# Altium schematic sheet [10] - CONNECTORs.SchDoc
size A3; DocumentNumber: 11; SheetNumber: 11; SheetTotal: 12
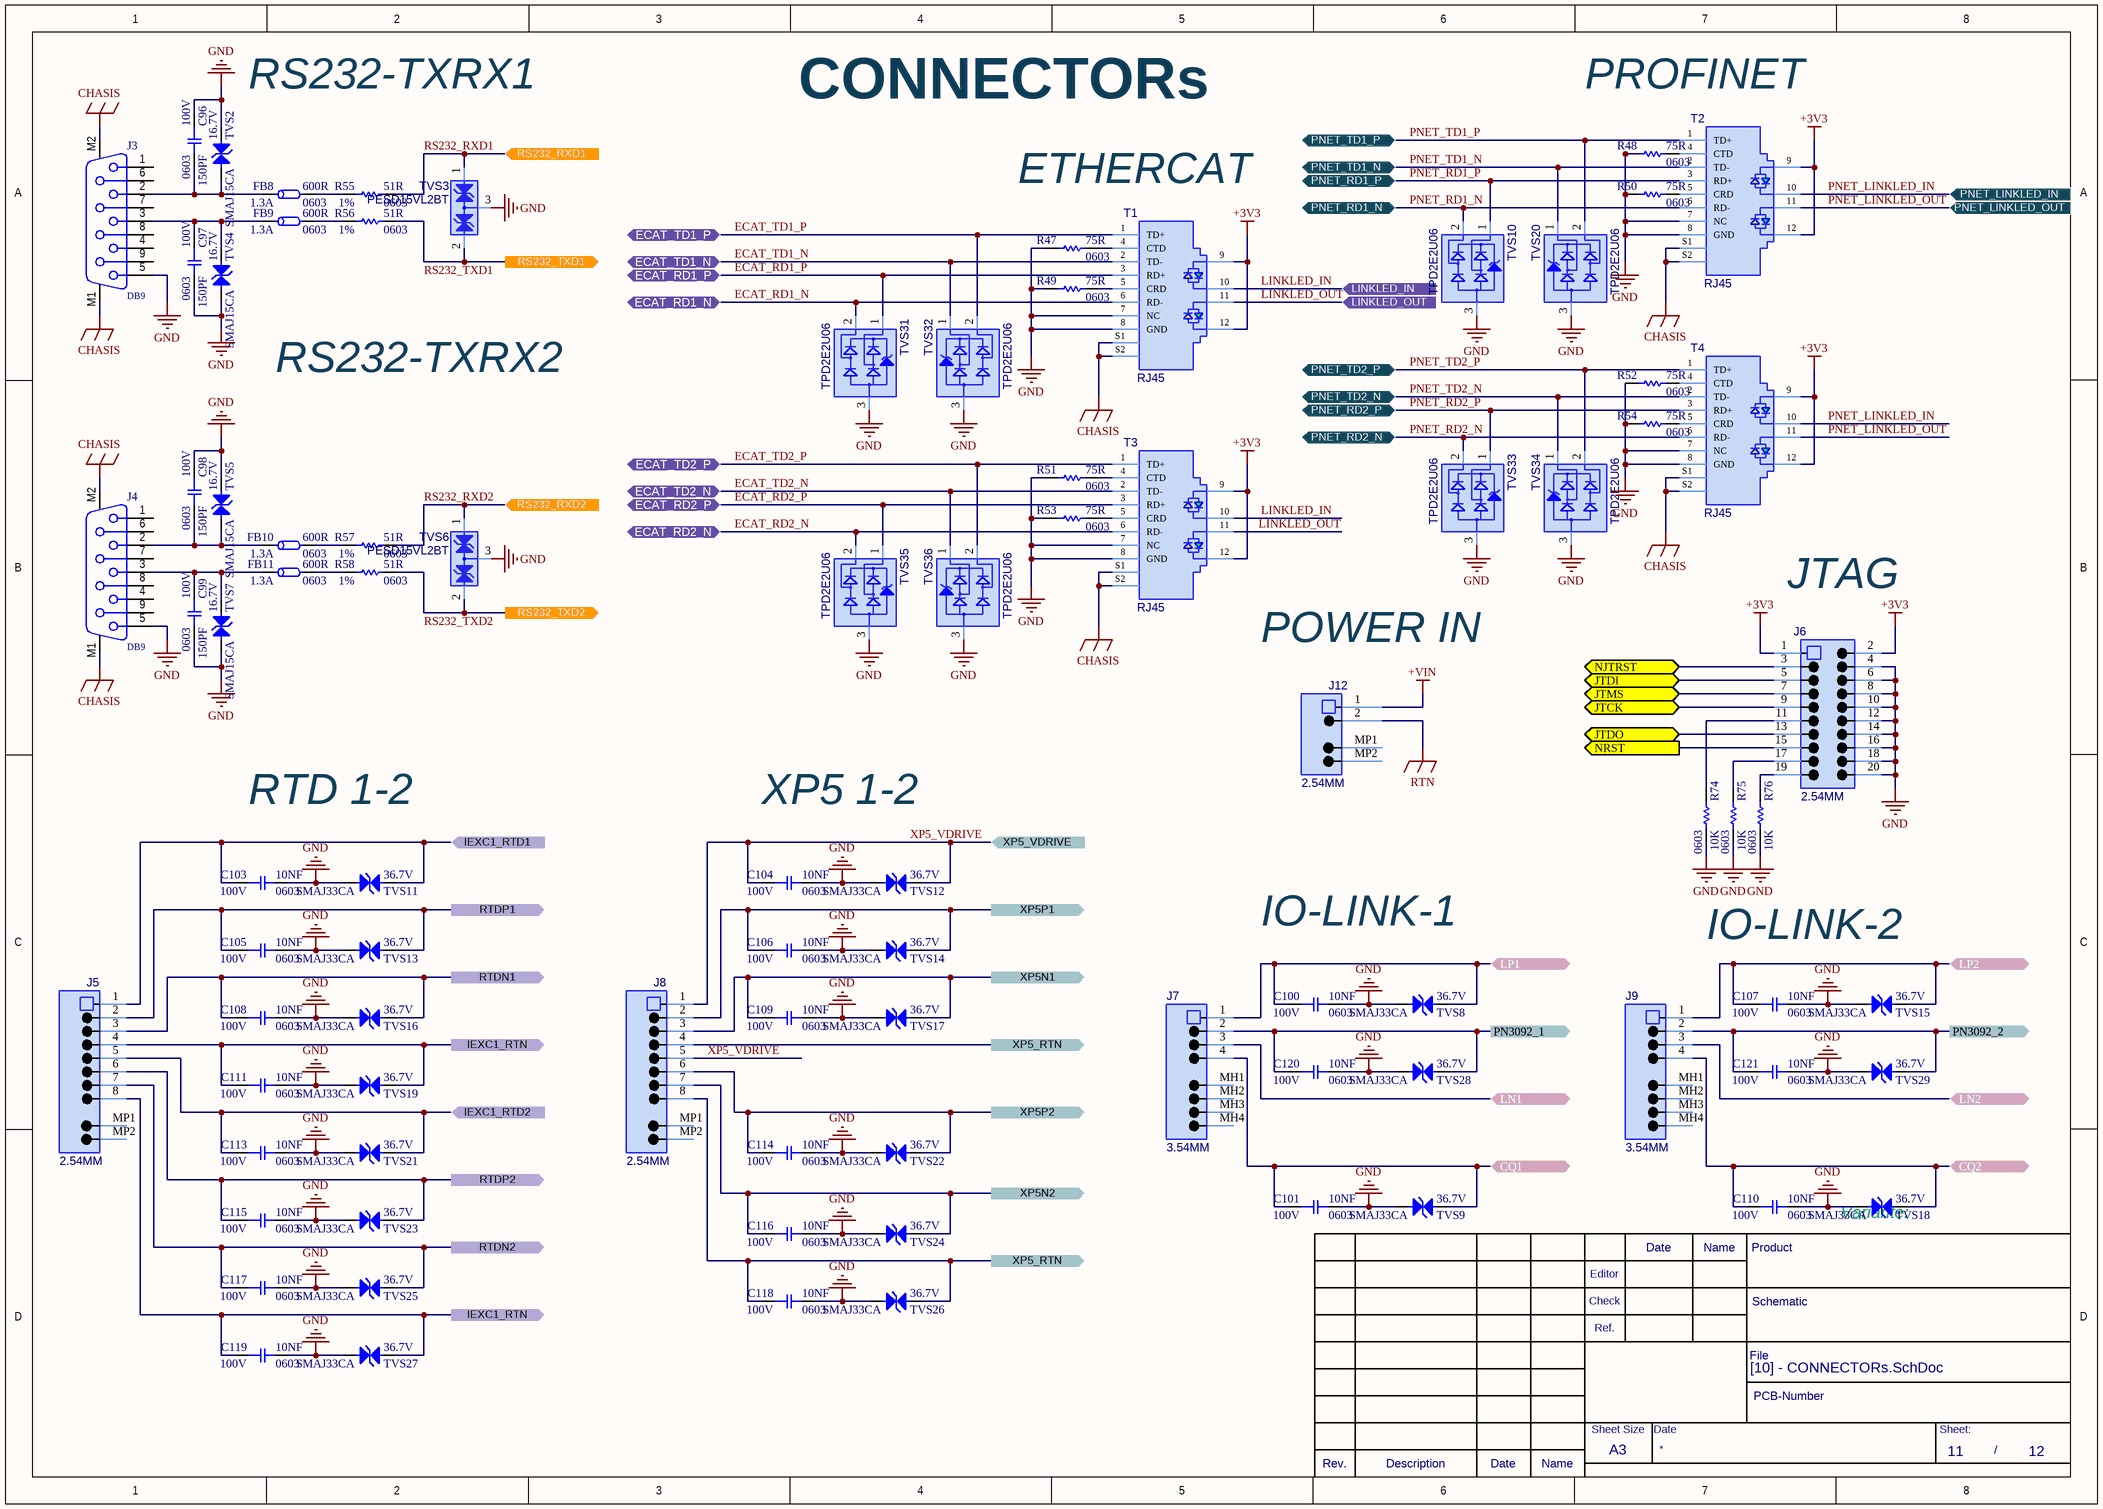
[diagram p0: [10] - CONNECTORs.SchDoc]

## Parts
C96  150PF  Case/Package: 0603  Voltage Rating: 100V  [C-0603]
C97  150PF  Case/Package: 0603  Voltage Rating: 100V  [C-0603]
C98  150PF  Case/Package: 0603  Voltage Rating: 100V  [C-0603]
C99  150PF  Case/Package: 0603  Voltage Rating: 100V  [C-0603]
C100  10NF  Voltage Rating: 100V  Case Code (Imperial): 0603  [C-0603]
C101  10NF  Voltage Rating: 100V  Case Code (Imperial): 0603  [C-0603]
C103  10NF  Voltage Rating: 100V  Case Code (Imperial): 0603  [C-0603]
C104  10NF  Voltage Rating: 100V  Case Code (Imperial): 0603  [C-0603]
C105  10NF  Voltage Rating: 100V  Case Code (Imperial): 0603  [C-0603]
C106  10NF  Voltage Rating: 100V  Case Code (Imperial): 0603  [C-0603]
C107  10NF  Voltage Rating: 100V  Case Code (Imperial): 0603  [C-0603]
C108  10NF  Voltage Rating: 100V  Case Code (Imperial): 0603  [C-0603]
C109  10NF  Voltage Rating: 100V  Case Code (Imperial): 0603  [C-0603]
C110  10NF  Voltage Rating: 100V  Case Code (Imperial): 0603  [C-0603]
C111  10NF  Voltage Rating: 100V  Case Code (Imperial): 0603  [C-0603]
C113  10NF  Voltage Rating: 100V  Case Code (Imperial): 0603  [C-0603]
C114  10NF  Voltage Rating: 100V  Case Code (Imperial): 0603  [C-0603]
C115  10NF  Voltage Rating: 100V  Case Code (Imperial): 0603  [C-0603]
C116  10NF  Voltage Rating: 100V  Case Code (Imperial): 0603  [C-0603]
C117  10NF  Voltage Rating: 100V  Case Code (Imperial): 0603  [C-0603]
C118  10NF  Voltage Rating: 100V  Case Code (Imperial): 0603  [C-0603]
C119  10NF  Voltage Rating: 100V  Case Code (Imperial): 0603  [C-0603]
C120  10NF  Voltage Rating: 100V  Case Code (Imperial): 0603  [C-0603]
C121  10NF  Voltage Rating: 100V  Case Code (Imperial): 0603  [C-0603]
FB8  600R  Current Rating: 1.3A  Case Code (Imperial): 0603  [FB-0603]
FB9  600R  Current Rating: 1.3A  Case Code (Imperial): 0603  [FB-0603]
FB10  600R  Current Rating: 1.3A  Case Code (Imperial): 0603  [FB-0603]
FB11  600R  Current Rating: 1.3A  Case Code (Imperial): 0603  [FB-0603]
J3  DB9  [CON-DB9-618009211821]
J4  DB9  [CON-DB9-618009211821]
J5  2.54MM  [CON-HARTING-8POS-2.54MM]
J6  2.54MM  [CON-SWD-20 POSITION]
J7  3.54MM  [CON-4PIN-IOLINK]
J8  2.54MM  [CON-HARTING-8POS-2.54MM]
J9  3.54MM  [CON-4PIN-IOLINK]
J12  2.54MM  [CON-HARTING-2POS-2.54MM]
R47  75R  Case/Package: 0603  [R-0603]
R48  75R  Case/Package: 0603  [R-0603]
R49  75R  Case/Package: 0603  [R-0603]
R50  75R  Case/Package: 0603  [R-0603]
R51  75R  Case/Package: 0603  [R-0603]
R52  75R  Case/Package: 0603  [R-0603]
R53  75R  Case/Package: 0603  [R-0603]
R54  75R  Case/Package: 0603  [R-0603]
R55  51R  Tolerance: 1%  Case/Package: 0603  [R-0603]
R56  51R  Tolerance: 1%  Case/Package: 0603  [R-0603]
R57  51R  Tolerance: 1%  Case/Package: 0603  [R-0603]
R58  51R  Tolerance: 1%  Case/Package: 0603  [R-0603]
R74  10K  Case Code (Imperial): 0603  [R-0603]
R75  10K  Case Code (Imperial): 0603  [R-0603]
R76  10K  Case Code (Imperial): 0603  [R-0603]
T1  RJ45  [CON-RJ45-74980104400]
T2  RJ45  [CON-RJ45-74980104400]
T3  RJ45  [CON-RJ45-74980104400]
T4  RJ45  [CON-RJ45-74980104400]
TVS2  SMAJ15CA  Min Breakdown Voltage: 16.7V  [D-SMA-DO214AC-CA]
TVS3  PESD15VL2BT  [SOT23-3]
TVS4  SMAJ15CA  Min Breakdown Voltage: 16.7V  [D-SMA-DO214AC-CA]
TVS5  SMAJ15CA  Min Breakdown Voltage: 16.7V  [D-SMA-DO214AC-CA]
TVS6  PESD15VL2BT  [SOT23-3]
TVS7  SMAJ15CA  Min Breakdown Voltage: 16.7V  [D-SMA-DO214AC-CA]
TVS8  SMAJ33CA  Reverse Breakdown Voltage: 36.7V  [D-SMA-DO214AC-CA]
TVS9  SMAJ33CA  Reverse Breakdown Voltage: 36.7V  [D-SMA-DO214AC-CA]
TVS10  TPD2E2U06  [SOT323-3]
TVS11  SMAJ33CA  Reverse Breakdown Voltage: 36.7V  [D-SMA-DO214AC-CA]
TVS12  SMAJ33CA  Reverse Breakdown Voltage: 36.7V  [D-SMA-DO214AC-CA]
TVS13  SMAJ33CA  Reverse Breakdown Voltage: 36.7V  [D-SMA-DO214AC-CA]
TVS14  SMAJ33CA  Reverse Breakdown Voltage: 36.7V  [D-SMA-DO214AC-CA]
TVS15  SMAJ33CA  Reverse Breakdown Voltage: 36.7V  [D-SMA-DO214AC-CA]
TVS16  SMAJ33CA  Reverse Breakdown Voltage: 36.7V  [D-SMA-DO214AC-CA]
TVS17  SMAJ33CA  Reverse Breakdown Voltage: 36.7V  [D-SMA-DO214AC-CA]
TVS18  SMAJ33CA  Reverse Breakdown Voltage: 36.7V  [D-SMA-DO214AC-CA]
TVS19  SMAJ33CA  Reverse Breakdown Voltage: 36.7V  [D-SMA-DO214AC-CA]
TVS20  TPD2E2U06  [SOT323-3]
TVS21  SMAJ33CA  Reverse Breakdown Voltage: 36.7V  [D-SMA-DO214AC-CA]
TVS22  SMAJ33CA  Reverse Breakdown Voltage: 36.7V  [D-SMA-DO214AC-CA]
TVS23  SMAJ33CA  Reverse Breakdown Voltage: 36.7V  [D-SMA-DO214AC-CA]
TVS24  SMAJ33CA  Reverse Breakdown Voltage: 36.7V  [D-SMA-DO214AC-CA]
TVS25  SMAJ33CA  Reverse Breakdown Voltage: 36.7V  [D-SMA-DO214AC-CA]
TVS26  SMAJ33CA  Reverse Breakdown Voltage: 36.7V  [D-SMA-DO214AC-CA]
TVS27  SMAJ33CA  Reverse Breakdown Voltage: 36.7V  [D-SMA-DO214AC-CA]
TVS28  SMAJ33CA  Reverse Breakdown Voltage: 36.7V  [D-SMA-DO214AC-CA]
TVS29  SMAJ33CA  Reverse Breakdown Voltage: 36.7V  [D-SMA-DO214AC-CA]
TVS31  TPD2E2U06  [SOT323-3]
TVS32  TPD2E2U06  [SOT323-3]
TVS33  TPD2E2U06  [SOT323-3]
TVS34  TPD2E2U06  [SOT323-3]
TVS35  TPD2E2U06  [SOT323-3]
TVS36  TPD2E2U06  [SOT323-3]

## Ports
CQ1 (bidir), CQ2 (bidir), ECAT_RD1_N (bidir), ECAT_RD1_P (bidir), ECAT_RD2_N (bidir), ECAT_RD2_P (bidir), ECAT_TD1_N (bidir), ECAT_TD1_P (bidir), ECAT_TD2_N (bidir), ECAT_TD2_P (bidir), IEXC1_RTD1 (in), IEXC1_RTD2 (in), IEXC1_RTN (out), JTCK (bidir), JTDI (bidir), JTDO (bidir), JTMS (bidir), LINKLED_IN (in), LINKLED_OUT (in), LN1 (bidir), LN2 (bidir), LP1 (bidir), LP2 (bidir), NJTRST (bidir), NRST (out), PN3092_1 (out), PN3092_2 (out), PNET_LINKLED_IN (in), PNET_LINKLED_OUT (in), PNET_RD1_N (bidir), PNET_RD1_P (bidir), PNET_RD2_N (bidir), PNET_RD2_P (bidir), PNET_TD1_N (bidir), PNET_TD1_P (bidir), PNET_TD2_N (bidir), PNET_TD2_P (bidir), RS232_RXD1 (in), RS232_RXD2 (in), RS232_TXD1 (out), RS232_TXD2 (out), RTDN1 (out), RTDN2 (out), RTDP1 (out), RTDP2 (out), XP5_RTN (out), XP5_VDRIVE (in), XP5N1 (out), XP5N2 (out), XP5P1 (out), XP5P2 (out)

## Nets
+3V3: J6.1 J6.2 T1.9 T1.12 T2.9 T2.12 T3.9 T3.12 T4.9 T4.12
+VIN: J12.1(GND_IN)
CHASIS: J3.M1 J3.M2 J4.M1 J4.M2 T1.S1(Shield) T1.S2(Shield) T2.S1(Shield) T2.S2(Shield) T3.S1(Shield) T3.S2(Shield) T4.S1(Shield) T4.S2(Shield)
GND: C96.1 C97.2 C98.1 C99.2 C100.2 C101.2 C103.2 C104.2 C105.2 C106.2 C107.2 C108.2 C109.2 C110.2 C111.2 C113.2 C114.2 C115.2 C116.2 C117.2 C118.2 C119.2 C120.2 C121.2 J3.5 J4.5 J6.4 J6.6 J6.8 J6.10 J6.12 J6.14 J6.16 J6.18 J6.20 R47.1 R48.1 R49.1 R50.1 R51.1 R52.1 R53.1 R54.1 R74.2 R75.2 R76.2 T1.7(NC) T1.8(GND) T2.7(NC) T2.8(GND) T3.7(NC) T3.8(GND) T4.7(NC) T4.8(GND) TVS2.A TVS3.3(GND) TVS4.C TVS5.A TVS6.3(GND) TVS7.C TVS8.C TVS9.C TVS10.3(GND) TVS11.C TVS12.C TVS13.C TVS14.C TVS15.C TVS16.C TVS17.C TVS18.C TVS19.C TVS20.3(GND) TVS21.C TVS22.C TVS23.C TVS24.C TVS25.C TVS26.C TVS27.C TVS28.C TVS29.C TVS31.3(GND) TVS32.3(GND) TVS33.3(GND) TVS34.3(GND) TVS35.3(GND) TVS36.3(GND)
RTN: J12.2
CQ1: C101.1 J7.4 TVS9.A ; port CQ1
CQ2: C110.1 J9.4 TVS18.A ; port CQ2
ECAT_RD1_N: T1.6(RD-) TVS31.2(I/O2) ; port ECAT_RD1_N
ECAT_RD1_P: T1.3(RD+) TVS31.1(I/O1) ; port ECAT_RD1_P
ECAT_RD2_N: T3.6(RD-) TVS35.2(I/O2) ; port ECAT_RD2_N
ECAT_RD2_P: T3.3(RD+) TVS35.1(I/O1) ; port ECAT_RD2_P
ECAT_TD1_N: T1.2(TD-) TVS32.1(I/O1) ; port ECAT_TD1_N
ECAT_TD1_P: T1.1(TD+) TVS32.2(I/O2) ; port ECAT_TD1_P
ECAT_TD2_N: T3.2(TD-) TVS36.1(I/O1) ; port ECAT_TD2_N
ECAT_TD2_P: T3.1(TD+) TVS36.2(I/O2) ; port ECAT_TD2_P
IEXC1_RTD1: C103.1 J5.1(GND_IN) TVS11.A ; port IEXC1_RTD1
IEXC1_RTD2: C113.1 J5.5 TVS21.A ; port IEXC1_RTD2
IEXC1_RTN: C111.1 C119.1 J5.4 J5.8 TVS19.A TVS27.A ; port IEXC1_RTN
JTCK: J6.9 ; port JTCK
JTDI: J6.5 ; port JTDI
JTDO: J6.13 ; port JTDO
JTMS: J6.7 ; port JTMS
LINKLED_IN: T1.10 T3.10 ; port LINKLED_IN
LINKLED_OUT: T1.11 T3.11 ; port LINKLED_OUT
LN1: J7.3 ; port LN1
LN2: J9.3 ; port LN2
LP1: C100.1 J7.1(GND_IN) TVS8.A ; port LP1
LP2: C107.1 J9.1(GND_IN) TVS15.A ; port LP2
NJTRST: J6.3 ; port NJTRST
NRST: J6.15 ; port NRST
PN3092_1: C120.1 J7.2 TVS28.A ; port PN3092_1
PN3092_2: C121.1 J9.2 TVS29.A ; port PN3092_2
PNET_LINKLED_IN: T2.10 T4.10 ; port PNET_LINKLED_IN
PNET_LINKLED_OUT: T2.11 T4.11 ; port PNET_LINKLED_OUT
PNET_RD1_N: T2.6(RD-) TVS10.2(I/O2) ; port PNET_RD1_N
PNET_RD1_P: T2.3(RD+) TVS10.1(I/O1) ; port PNET_RD1_P
PNET_RD2_N: T4.6(RD-) TVS33.2(I/O2) ; port PNET_RD2_N
PNET_RD2_P: T4.3(RD+) TVS33.1(I/O1) ; port PNET_RD2_P
PNET_TD1_N: T2.2(TD-) TVS20.1(I/O1) ; port PNET_TD1_N
PNET_TD1_P: T2.1(TD+) TVS20.2(I/O2) ; port PNET_TD1_P
PNET_TD2_N: T4.2(TD-) TVS34.1(I/O1) ; port PNET_TD2_N
PNET_TD2_P: T4.1(TD+) TVS34.2(I/O2) ; port PNET_TD2_P
RS232_RXD1: R55.2 TVS3.1(I/O1) ; port RS232_RXD1
RS232_RXD2: R57.2 TVS6.1(I/O1) ; port RS232_RXD2
RS232_TXD1: R56.2 TVS3.2(I/O2) ; port RS232_TXD1
RS232_TXD2: R58.2 TVS6.2(I/O2) ; port RS232_TXD2
RTDN1: C108.1 J5.3 TVS16.A ; port RTDN1
RTDN2: C117.1 J5.7 TVS25.A ; port RTDN2
RTDP1: C105.1 J5.2 TVS13.A ; port RTDP1
RTDP2: C115.1 J5.6 TVS23.A ; port RTDP2
XP5_RTN: C118.1 J8.4 J8.8 TVS26.A ; port XP5_RTN
XP5_VDRIVE: C104.1 J8.1(GND_IN) J8.5 TVS12.A ; port XP5_VDRIVE
XP5N1: C109.1 J8.3 TVS17.A ; port XP5N1
XP5N2: C116.1 J8.7 TVS24.A ; port XP5N2
XP5P1: C106.1 J8.2 TVS14.A ; port XP5P1
XP5P2: C114.1 J8.6 TVS22.A ; port XP5P2
NetC96_2: C96.2 FB8.1 J3.2 TVS2.C
NetC97_1: C97.1 FB9.1 J3.3 TVS4.A
NetC98_2: C98.2 FB10.1 J4.2 TVS5.C
NetC99_1: C99.1 FB11.1 J4.3 TVS7.A
NetFB8_2: FB8.2 R55.1
NetFB9_2: FB9.2 R56.1
NetFB10_2: FB10.2 R57.1
NetFB11_2: FB11.2 R58.1
NetJ6_11: J6.11 R74.1
NetJ6_17: J6.17 R75.1
NetJ6_19: J6.19 R76.1
NetR47_2: R47.2 T1.4(CTD)
NetR48_2: R48.2 T2.4(CTD)
NetR49_2: R49.2 T1.5(CRD)
NetR50_2: R50.2 T2.5(CRD)
NetR51_2: R51.2 T3.4(CTD)
NetR52_2: R52.2 T4.4(CTD)
NetR53_2: R53.2 T3.5(CRD)
NetR54_2: R54.2 T4.5(CRD)

Not connected (* = marked no-connect by the designer): J3 1 4 6 7 8 9; J4 1 4 6 7 8 9; J5 MP1 MP2; J7 MH1 MH2 MH3 MH4; J8 MP1 MP2; J9 MH1 MH2 MH3 MH4; J12 MP1 MP2

## Notes on the sheet
- RS232-TXRX1
- CONNECTORs
- PROFINET
- ETHERCAT
- RS232-TXRX2
- POWER IN
- JTAG
- RTD 1-2
- XP5 1-2
- IO-LINK-1
- IO-LINK-2
- Date
- Name
- Product
- Variante:
- Editor
- Check
- Ref.
- Schematic
- File
- PCB-Number
- Rev.
- Description
- Sheet Size
- A3
- Sheet:
- /

## Library data of the parts
C96-C99 = C-150PF-0603: CAP CER 150PF 100V C0G/NP0 0603; Manufacturer: KEMET; Manufacturer Part Number: C0603C151J1GACTU; Dielectric Material: Ceramic; Dielectric: C0G; Tolerance: 5%; Temperature Coefficient: 30ppm/°C; Washability: OK; .Creator: M.OZKAN; .PCBCHK: USED; Supplier 1: Digi-Key; Stock 1: 40687; Pricing: 1=0.10000, 10=0.07000, 100=0.03100, 500=0.02214, 1000=0.01739 (USD); RoHS: Yes; Mount: Surface Mount; Number of Pins: 2; Case Code (Metric): 1608; Case Code (Imperial): 0603; Min Operating Temperature: -55°C; Max Operating Temperature: 125°C; Capacitance: 150pF; Packaging: Tape and Reel; Voltage Rating (DC): 100V; Termination: SMD/SMT; Package Quantity: 4000; Length: 1.6mm; Height: 0.8mm; Width: 0.031inch; Depth: 0.8mm; Thickness: 0.034inch; Lead Pitch: 0.7mm; Radiation Hardening: No; Lead Free: Lead Free; REACH SVHC: No SVHC; ComponentLink1URL: https://datasheet.ciiva.com/5421/kem-c1003-c0g-smd-5421417.pdf?src-supplier=Mouser; ComponentLink1Description: https://datasheet.ciiva.com/5421/kem-c1003-c0g-smd-5421417.pdf?src-supplier=Mouser; ComponentLink2URL: https://datasheet.ciiva.com/7823/40889-7823630.pdf?src-supplier=Element14; ComponentLink2Description: https://datasheet.ciiva.com/7823/40889-7823630.pdf?src-supplier=Element14; Supplier Part Number 1: 399-9007-1-ND; .SCHCHK: USED
C100 C101 C103-C111 C113-C121 = C-10NF-0603: CAP CER 10000PF 100V X7R 0603; Manufacturer: TDK; Manufacturer Part Number: C1608X7R2A103M080AA; Tolerance: 20%; Dielectric Material: Ceramic; .PCBCHK: USED; .Creator: M.OZKAN; Washability: OK; Supplier 1: Digi-Key; Supplier Part Number 1: 445-1305-6-ND; Stock 1: 40000; Pricing 1: 1=0.11, 10=0.079, 100=0.0352, 500=0.02516, 1000=0.01977 (USD); Mount: Surface Mount; Case/Package: 0603; Number of Pins: 2; Weight: 7.1E-05oz; Case Code (Metric): 1608; Min Operating Temperature: -55°C; Max Operating Temperature: 125°C; Package Quantity: 1; Capacitance: 10nF; Packaging: Tape and Reel; Voltage Rating (DC): 100V; Dielectric: X7R; Termination: SMD/SMT; Composition: Ceramic; Length: 1.6mm; Height: 0.8mm; Width: 0.031inch; Depth: 0.8mm; Thickness: 0.037inch; REACH SVHC: No SVHC; ComponentLink1URL: http://www.mouser.com/ds/2/400/lcc_commercial_general_en-837201.pdf; ComponentLink1Description: http://www.mouser.com/ds/2/400/lcc_commercial_general_en-837201.pdf; ComponentLink2URL: http://www.farnell.com/datasheets/1484596.pdf; ComponentLink2Description: http://www.farnell.com/datasheets/1484596.pdf; Supplier 2: Digi-Key; Supplier Part Number 2: 1276-6556-6-ND; Stock 2: 40000; Pricing 2: 1=0.1, 10=0.066, 100=0.0293, 500=0.02092, 1000=0.01643 (USD); Features: Soft Termination; Ratings: AEC-Q200; Supplier 3: Digi-Key; Supplier Part Number 3: 478-10798-6-ND; Stock 3: 89508; Pricing 3: 1=0.13, 10=0.099, 100=0.0439, 500=0.03138, 1000=0.02465, 2500=0.02241, 5000=0.02062 (USD); Radiation Hardening: No; Lead Free: Lead Free; ComponentLink3URL: https://www.verical.com/server-webapp/html/getDatasheet?partID=126825; ComponentLink3Description: https://www.verical.com/server-webapp/html/getDatasheet?partID=126825; ComponentLink4URL: http://www.avx.com/docs/Catalogs/cauto.pdf; ComponentLink4Description: http://www.avx.com/docs/Catalogs/cauto.pdf; ComponentLink5URL: http://www.mouser.com/ds/2/40/AutoMLCC-777028.pdf; ComponentLink5Description: http://www.mouser.com/ds/2/40/AutoMLCC-777028.pdf; .SCHCHK: USED
FB8-FB11 = FB-600R-0603_1: FERRITE BEAD 600 OHM 0603 1LN; Manufacturer: Murata; Manufacturer Part Number: BLM18KG601SN1D; Material: Ferrite,Steel; Tolerance: 25%; DC Resistance (DCR): 150mR; Test Frequency: 100MHz; Number of Lines: 1; .PCBCHK: USED; .Creator: F:TALI; Washability: OK; Supplier 1: Digi-Key; Stock 1: 578615; Pricing 1: 1=0.1, 10=0.079, 25=0.0712, 50=0.0522, 100=0.0451, 250=0.03564, 500=0.0301, 1000=0.02534 (USD); Case/Package: 0603; Number of Pins: 2; Weight: 7.1E-05oz; Core Material: Ferrite; Case Code (Metric): 1608; Min Operating Temperature: -55°C; Max Operating Temperature: 125°C; Impedance: 600R; Package Quantity: 1; Packaging: Tape and Reel; Max Current Rating: 1.3A; Termination: SMD/SMT; Max DC Current: 1.3A; DC Current: 1.3A; Military Standard: Not; Number of Circuits: 1; Length: 1.6mm; Height: 0.8mm; Width: 0.8mm; Depth: 0.8mm; Radiation Hardening: No; REACH SVHC: No SVHC; Lead Free: Lead Free; ComponentLink1URL: https://www.verical.com/server-webapp/html/getDatasheet?partID=226848; ComponentLink1Description: https://www.verical.com/server-webapp/html/getDatasheet?partID=226848; ComponentLink2URL: http://www.murata.com/products/catalog/pdf/c31e.pdf; ComponentLink2Description: http://www.murata.com/products/catalog/pdf/c31e.pdf; ComponentLink3URL: http://www.farnell.com/datasheets/486545.pdf; ComponentLink3Description: http://www.farnell.com/datasheets/486545.pdf; ComponentLink4URL: https://media.digikey.com/pdf/Data%20Sheets/Murata%20PDFs/BLM18yyyyyyN1x.pdf; ComponentLink4Description: https://media.digikey.com/pdf/Data%20Sheets/Murata%20PDFs/BLM18yyyyyyN1x.pdf; ComponentLink5URL: http://uk.rs-online.com/webdocs/13ed/0900766b813ed050.pdf; ComponentLink5Description: http://uk.rs-online.com/webdocs/13ed/0900766b813ed050.pdf; Supplier Part Number 1: 490-5258-6-ND; .SCHCHK: USED
J3 J4 = CON-DB9-FEMALE: WR-DSUB FEMALE ANGLED PCB CONNEC; Manufacturer: Wurth Electronics; Manufacturer Part Number: 618009211821; ComponentLink1Description: Manufacturer; ComponentLink1URL: http://www.we-online.de; ComponentLink2Description: Datasheet; ComponentLink2URL: https://katalog.we-online.de/em/datasheet/6180xx211821.pdf; Supplier 1: Digi-Key; Supplier Part Number 1: 732-618009211821-ND; Stock: 78; Pricing: 1=2.47, 10=2.343, 50=2.081, 100=1.815, 250=1.557, 500=1.387 (USD); RoHS: No
J5 J8 = CON-8POS-2.54MM-SMD: TERM BLK 8P SIDE ENT 2.54MM SMD; Manufacturer: HARTING Technology; Manufacturer Part Number: 14010813102000; Gender: Receptacle; Voltage Rating: 160V; Number of Levels: 1; Number of Positions Per Level: 8; Current: 6A; Current Rating: 8.4A; Pitch: 0.1inch; Wire Gauge (Max): 26AWG; Wire Gauge (Min): 20AWG; Supplier 1: Digi-Key; Supplier Part Number 1: 1195-3662-1-ND; Stock: 484; Pricing: 1=2.11, 10=1.913, 100=1.6401 (USD); RoHS: Yes; Mount: Surface Mount,Panel; Contact Plating: Tin; Contact Material: Copper; Color: Black; Material: Polymer,Glass fibre; Housing Material: Liquid Crystal Polymer; Min Operating Temperature: -40°C; Max Operating Temperature: 125°C; Packaging: Tape and Reel; Voltage: 160V; Termination: Screwless; Number of Contacts: 8; Number of Rows: 2; Orientation: Horizontal; Length: 25.01mm; Width: 9.2mm; Depth: 5mm; REACH SVHC: No SVHC; ComponentLink1URL: https://datasheet.ciiva.com/48506/harting-1401xx13102000-eng-tds01-48506086.pdf?src-supplier=Distrelec; ComponentLink1Description: https://datasheet.ciiva.com/48506/harting-1401xx13102000-eng-tds01-48506086.pdf?src-supplier=Distrelec; ComponentLink2URL: https://datasheet.ciiva.com/46428/1817031-46428390.pdf?src-supplier=Element14; ComponentLink2Description: https://datasheet.ciiva.com/46428/1817031-46428390.pdf?src-supplier=Element14; ComponentLink3URL: https://datasheet.ciiva.com/49025/70357504-49025163.pdf?src-supplier=Allied+Electronics; ComponentLink3Description: https://datasheet.ciiva.com/49025/70357504-49025163.pdf?src-supplier=Allied+Electronics
J6 = CON-20POS-2.54MM HEADER: CONN HEADER VERT 20POS 2.54MM; Manufacturer: On Shore Technology Inc.; Manufacturer Part Number: 302-S201; Voltage Rating: 1kV; Current Rating: 3A; Contact Resistance: 20mR; Connector Type: Receptacle; Number of Positions: 20; Row Spacing: 0.1inch; Stock: 6320; Pricing: 1=1.41, 10=1.243, 100=1.0728 (USD); RoHS: Yes; Mount: Surface Mount; Housing Color: Grey; Contact Plating: Gold; Color: Grey; Contact Material: Bronze; Housing Material: Thermoplastic; Min Operating Temperature: -65°C; Max Operating Temperature: 125°C; Orientation: Straight; Packaging: Tape and Reel; Number of Rows: 2; Package Quantity: 650; Termination: Solder; Number of Contacts: 20; Max Voltage Rating (AC): 1kV; Gender: Receptacle; Length: 15.16mm; Pitch: 2.54mm; Depth: 5.08mm; Radiation Hardening: No; Lead Free: Lead Free; REACH SVHC: No SVHC; ComponentLink1URL: https://datasheet.ciiva.com/9473/89898-9473111.pdf?src-supplier=Avnet; ComponentLink1Description: https://datasheet.ciiva.com/9473/89898-9473111.pdf?src-supplier=Avnet; ComponentLink2URL: https://datasheet.ciiva.com/412/89898-412170.pdf?src-supplier=Digi-Key; ComponentLink2Description: https://datasheet.ciiva.com/412/89898-412170.pdf?src-supplier=Digi-Key; ComponentLink3URL: https://datasheet.ciiva.com/16731/89898-16731623.pdf?src-supplier=Avnet+Europe; ComponentLink3Description: https://datasheet.ciiva.com/16731/89898-16731623.pdf?src-supplier=Avnet+Europe; ComponentLink4URL: https://datasheet.ciiva.com/46428/320508-46428539.pdf?src-supplier=Element14; ComponentLink4Description: https://datasheet.ciiva.com/46428/320508-46428539.pdf?src-supplier=Element14
J7 J9 = CON-4POS-IOLINK: CONN PLUG FMALE 4POS GOLD SOLDER; Manufacturer: TE Connectivity; Manufacturer Part Number: T4145515041-001; Plating: Nickel; Connector Type: Receptacle,Socket; Connector System: Wire-to-Board; Mating Retention: Yes (With); Number of Positions: 4; Shielding: Unshielded; Supplier 1: Digi-Key; Supplier Part Number 1: A126539-ND; Stock: 398; Pricing: 1=7.15, 10=6.854, 25=6.258, 50=5.96, 100=5.662, 250=5.066, 500=4.768, 1000=4.172, 2500=3.9634 (USD); RoHS: No; Mount: Panel; Insulation Material: Polyamide; Shell Material: Brass; Min Operating Temperature: -40°C; Max Operating Temperature: 85°C; Number of Signal Positions: 4; Sealable: Yes (With)
J12 = CON-2POS-2.54MM-SMD: TERM BLK 2P SIDE ENT 2.54MM SMD; Manufacturer: HARTING Technology; Manufacturer Part Number: 14010213102000; Current Rating: 8.4A; Gender: Receptacle; Voltage Rating: 160V; Number of Levels: 1; Number of Positions Per Level: 2; Current: 6A; Pitch: 0.1inch; Wire Gauge (Max): 26AWG; Wire Gauge (Min): 20AWG; Supplier 1: Digi-Key; Supplier Part Number 1: 1195-3656-1-ND; Stock: 967; Pricing: 1=1.05, 10=0.926, 100=0.7986 (USD); RoHS: Yes; Mount: Surface Mount; Contact Material: Copper; Color: Black; Contact Plating: Tin; Housing Material: Polymer; Material: Polymer,Glass fibre; Min Operating Temperature: -40°C; Max Operating Temperature: 125°C; Termination: Screwless; Number of Rows: 2; Orientation: Horizontal; Packaging: Tape and Reel; Voltage: 160V; Number of Contacts: 2; Number of Poles: 2; Contact Gender: Female; Length: 9.77mm; Width: 9.2mm; Depth: 5mm; REACH SVHC: No SVHC; ComponentLink1URL: https://datasheet.ciiva.com/46428/1817031-46428378.pdf?src-supplier=Element14; ComponentLink1Description: https://datasheet.ciiva.com/46428/1817031-46428378.pdf?src-supplier=Element14
R47-R54 = R-75R-0603: RES SMD 75 OHM 1% 1/10W 0603; Manufacturer Part Number: RMCF0603FT75R0; Manufacturer: Stackpole Electronics; Max Power Dissipation: 100mW; Temperature Coefficient: 100ppm/°C; Washability: OK; .Creator: M.OZKAN; .PCBCHK: USED; Supplier 1: Digi-Key; RoHS: Yes; Mount: Surface Mount; Case Code (Metric): 1608; Case Code (Imperial): 0603; Min Operating Temperature: -55°C; Max Operating Temperature: 155°C; Packaging: Tape and Reel; Composition: Thick Film; Number of Terminations: 2; Resistance: 75R; Features: Automotive AEC-Q200; Tolerance: 1%; Length: 0.061inch; Height: 0.022inch; Width: 0.031inch; ComponentLink1URL: https://datasheet.ciiva.com/15193/getdatasheetpartid-701591-15193493.pdf?src-supplier=Verical; ComponentLink1Description: https://datasheet.ciiva.com/15193/getdatasheetpartid-701591-15193493.pdf?src-supplier=Verical; Supplier Part Number 1: RMCF0603FT75R0CT-ND; Stock 1: 169664; Pricing 1: 1=0,10000, 10=0,01600, 100=0,00650, 1000=0,00292, 2500=0,00253 (USD); Contact Plating: Tin,Matte; Military Standard: Not; Depth: 0.8mm; Radiation Hardening: No; .SCHCHK: USED
R55-R58 = R-51R-0603: RES 51 OHM 1% 1/10W 0603; Manufacturer: Stackpole Electronics; Manufacturer Part Number: RMCF0603FT51R0; Max Power Dissipation: 100mW; Temperature Coefficient: 100ppm/°C; Supplier 1: Digi-Key; Supplier Part Number 1: RMCF0603FT51R0CT-ND; Stock: 90930; Pricing: 1=0.1, 10=0.015, 100=0.0063, 1000=0.0028, 2500=0.0024 (USD); RoHS: Yes; Mount: Surface Mount; Case Code (Imperial): 0603; Case Code (Metric): 1608; Contact Plating: Tin,Matte; Min Operating Temperature: -55°C; Max Operating Temperature: 155°C; Resistance: 51R; Packaging: Tape and Reel; Composition: Thick Film; Number of Terminations: 2; Features: Automotive AEC-Q200; Length: 0.061inch; Height: 0.022inch; Width: 0.031inch; Radiation Hardening: No; Lead Free: Lead Free; ComponentLink1URL: https://www.seielect.com/catalog/SEI-Packaging.pdf?src-supplier=Digi-Key; ComponentLink1Description: https://www.seielect.com/catalog/SEI-Packaging.pdf?src-supplier=Digi-Key; ComponentLink2URL: https://www.seielect.com/catalog/SEI-RMCF_RMCP.pdf?src-supplier=Avnet; ComponentLink2Description: https://www.seielect.com/catalog/SEI-RMCF_RMCP.pdf?src-supplier=Avnet
R74-R76 = R-10K-0603: RES SMD 10K OHM 1% 1/10W 0603; Manufacturer: Yageo; Manufacturer Part Number: RC0603FR-0710KL; Resistance: 10kR; Temperature Coefficient: 100ppm/°C; Voltage Rating (DC): 50V; Power Rating: 100mW; Voltage Rating: 75V; .PCBCHK: USED; .Creator: F:TALI; Washability: OK; Supplier 1: Digi-Key; Supplier Part Number 1: 311-10.0KHRCT-ND; Stock 1: 37479107; Pricing 1: 1=0.1, 10=0.026, 100=0.0107, 1000=0.00478, 2500=0.00415 (USD); Case/Package: 0603; Number of Pins: 2; Weight: 7.1E-05oz; Case Code (Metric): 1608; Min Operating Temperature: -55°C; Max Operating Temperature: 155°C; Tolerance: 1%; Composition: Thick Film; Packaging: Tape and Reel; Military Standard: Not; Termination: SMD/SMT; Length: 1.6mm; Height: 0.45mm; Width: 0.8mm; Depth: 0.8mm; Lead Pitch: 0.3mm; REACH SVHC: No SVHC; Lead Free: Lead Free; ComponentLink1URL: http://www.farnell.com/datasheets/38590.pdf; ComponentLink1Description: http://www.farnell.com/datasheets/38590.pdf; ComponentLink2URL: https://www.verical.com/server-webapp/html/getDatasheet?partID=409289; ComponentLink2Description: https://www.verical.com/server-webapp/html/getDatasheet?partID=409289; ComponentLink3URL: http://www.farnell.com/datasheets/1868787.pdf; ComponentLink3Description: http://www.farnell.com/datasheets/1868787.pdf; ComponentLink4URL: http://www.farnell.com/datasheets/443971.pdf; ComponentLink4Description: http://www.farnell.com/datasheets/443971.pdf; ComponentLink5URL: http://www.farnell.com/datasheets/1738695.pdf; ComponentLink5Description: http://www.farnell.com/datasheets/1738695.pdf; Supplier 2: Digi-Key; Supplier Part Number 2: 311-10KGRDKR-ND; Stock 2: 34952003; Pricing 2: 1=0.1, 10=0.022, 100=0.0088, 1000=0.00396, 2500=0.00344 (USD); Contact Plating: Matte,Tin; Radiation Hardening: No; ComponentLink6URL: http://www.yageo.com/documents/recent/PYu-RC_Group_51_RoHS_L_9.pdf; ComponentLink6Description: http://www.yageo.com/documents/recent/PYu-RC_Group_51_RoHS_L_9.pdf; ComponentLink7URL: https://www.verical.com/server-webapp/html/getDatasheet?partID=327958; ComponentLink7Description: https://www.verical.com/server-webapp/html/getDatasheet?partID=327958; ComponentLink8URL: http://www.yageo.com/documents/recent/PYu-RC_Group_51_RoHS_L_2.pdf; ComponentLink8Description: http://www.yageo.com/documents/recent/PYu-RC_Group_51_RoHS_L_2.pdf; Mount: Surface Mount; Package Quantity: 1; Number of Terminations: 2; Max Power Dissipation: 100mW; Working Voltage: 75V; Features: Automotive AEC-Q200; ComponentLink9URL: http://www.farnell.com/datasheets/1678796.pdf; ComponentLink9Description: http://www.farnell.com/datasheets/1678796.pdf; ComponentLink10URL: http://industrial.panasonic.com/www-cgi/jvcr13pz.cgi?E+PZ+3+AOA0002+ERJ1GNJ120C+7+WW; ComponentLink10Description: http://industrial.panasonic.com/www-cgi/jvcr13pz.cgi?E+PZ+3+AOA0002+ERJ1GNJ120C+7+WW; ComponentLink11URL: http://industrial.panasonic.com/www-data/pdf/AOA0000/AOA0000CE1.pdf; ComponentLink11Description: http://industrial.panasonic.com/www-data/pdf/AOA0000/AOA0000CE1.pdf; ComponentLink12URL: http://www.jameco.com/Jameco/Products/ProdDS/2007265.pdf; ComponentLink12Description: http://www.jameco.com/Jameco/Products/ProdDS/2007265.pdf; ComponentLink13URL: https://industrial.panasonic.com/cdbs/www-data/pdf/RDA0000/AOA0000C301.pdf; ComponentLink13Description: https://industrial.panasonic.com/cdbs/www-data/pdf/RDA0000/AOA0000C301.pdf; Supplier 3: Digi-Key; Supplier Part Number 3: YAG1290DKR-ND; Stock 3: 0; Pricing 3: 1=0.1, 10=0.044, 100=0.0178, 1000=0.00798, 2500=0.00693 (USD); .SCHCHK: USED
T1-T4 = CON-RJ45-74980104400: CONN JACK 1PORT 100 BASE-T PCB; Manufacturer: Wurth Electronics; ComponentLink1Description: Manufacturer; ComponentLink1URL: http://www.we-online.de; ComponentLink2Description: Datasheet; ComponentLink2URL: https://www.we-online.com/catalog/datasheet/74980104400.pdf; Manufacturer Part Number: 74980104400; Supplier 1: Digi-Key; Supplier Part Number 1: 732-13939-1-ND; Stock: 86; Pricing: 1=5.82, 5=5.2, 10=4.78, 50=4.26 (USD); RoHS: No
TVS2 TVS4 TVS5 TVS7 = TVS-SMAJ15CA: TVS DIODE 15V 24.4V DO214AC; Manufacturer: Littelfuse; Power Dissipation: 400W; Number of Elements: 1; Element Configuration: Single; Leakage Current: 1uA; Polarity: Bidirectional; Power Line Protection: No; Peak Pulse Current: 16.4A; Test Current: 1mA; Max Breakdown Voltage: 18.5V; Max Power Dissipation: 3.3W; Supplier 1: Digi-Key; Supplier Part Number 1: SMAJ15CALFCT-ND; Manufacturer Part Number: SMAJ15CA; Stock: 47858; Pricing: 1=0.41, 10=0.275, 100=0.1625, 500=0.11, 1000=0.0825 (USD); RoHS: Yes; Mount: Surface Mount; Number of Pins: 2; Min Operating Temperature: -65°C; Max Operating Temperature: 150°C; Packaging: Tape and Reel; Voltage Rating (DC): 15V; Package Quantity: 5000; Reverse Breakdown Voltage: 16.7V; Composition: Zener; Number of Channels: 1; Breakdown Voltage: 16.7V; Clamping Voltage: 24.4V; Peak Pulse Power: 400W; Termination: SMD/SMT; Number of Bidirectional Channels: 1; Reverse Standoff Voltage: 15V; Max Reverse Leakage Current: 1uA; Direction: Bidirectional; Operating Supply Voltage: 15V; Max Surge Current: 16.4A; Length: 4.5mm; Height: 2.087mm; Width: 2.79mm; Radiation Hardening: No; REACH SVHC: No SVHC; Lead Free: Lead Free; ComponentLink1URL: https://datasheet.ciiva.com/25624/0900766b810f4edb-25624840.pdf?src-supplier=RSComponents; ComponentLink1Description: https://datasheet.ciiva.com/25624/0900766b810f4edb-25624840.pdf?src-supplier=RSComponents; ComponentLink2URL: https://datasheet.ciiva.com/331/littelfuse-tvs-diode-smaj-datasheet-pdf-331084.pdf?src-supplier=Digi-Key; ComponentLink2Description: https://datasheet.ciiva.com/331/littelfuse-tvs-diode-smaj-datasheet-pdf-331084.pdf?src-supplier=Digi-Key; ComponentLink3URL: https://datasheet.ciiva.com/28473/607617-28473388.pdf?src-supplier=Element14; ComponentLink3Description: https://datasheet.ciiva.com/28473/607617-28473388.pdf?src-supplier=Element14; ComponentLink4URL: https://datasheet.ciiva.com/331/littelfuse-tvs-diode-smaj-datasheet-pdf-331085.pdf?src-supplier=Digi-Key; ComponentLink4Description: https://datasheet.ciiva.com/331/littelfuse-tvs-diode-smaj-datasheet-pdf-331085.pdf?src-supplier=Digi-Key; ComponentLink5URL: https://datasheet.ciiva.com/331/littelfuse-tvs-diode-smaj-datasheet-pdf-331086.pdf?src-supplier=Digi-Key; ComponentLink5Description: https://datasheet.ciiva.com/331/littelfuse-tvs-diode-smaj-datasheet-pdf-331086.pdf?src-supplier=Digi-Key; ComponentLink6URL: https://datasheet.ciiva.com/16487/littelfuse-tvs-diode-smaj-16487445.pdf?src-supplier=Future+Electronics; ComponentLink6Description: https://datasheet.ciiva.com/16487/littelfuse-tvs-diode-smaj-16487445.pdf?src-supplier=Future+Electronics; ComponentLink7URL: https://datasheet.ciiva.com/8062/littelfuse-tvs-diode-smaj-8062270.pdf?src-supplier=Element14; ComponentLink7Description: https://datasheet.ciiva.com/8062/littelfuse-tvs-diode-smaj-8062270.pdf?src-supplier=Element14
TVS3 TVS6 = TVS-PESD15VL2BT,215: TVS DIODE 15V 44V SOT23; Manufacturer: Nexperia; Supplier 1: Digi-Key; Supplier Part Number 1: 1727-3813-1-ND; Manufacturer Part Number: PESD15VL2BT,215; Stock: 63222; Pricing: 1=0.45, 10=0.308, 100=0.182, 500=0.1232, 1000=0.0924 (USD); RoHS: No; ComponentLink1URL: https://assets.nexperia.com/documents/data-sheet/PESDXL2BT_SER.pdf?src-supplier=Digi-Key; ComponentLink1Description: https://assets.nexperia.com/documents/data-sheet/PESDXL2BT_SER.pdf?src-supplier=Digi-Key
TVS8 TVS9 TVS11-TVS19 TVS21-TVS29 = TVS-SMAJ33CA: TVS DIODE 33V 53.3V DO214AC; Manufacturer: Littelfuse; Direction: Bidirectional; Max Surge Current: 7.5A; Number of Channels: 1; Peak Pulse Power: 400W; Power Line Protection: No; Max Breakdown Voltage: 40.6V; Test Current: 1mA; Max Power Dissipation: 3.3W; Leakage Current: 1uA; Supplier 1: Digi-Key; Supplier Part Number 1: SMAJ33CALFCT-ND; Manufacturer Part Number: SMAJ33CA; Stock: 28291; Pricing: 1=0.41, 10=0.275, 100=0.1625, 500=0.11, 1000=0.0825 (USD); RoHS: Yes; Mount: Surface Mount; Number of Pins: 2; Min Operating Temperature: -65°C; Max Operating Temperature: 150°C; Packaging: Tape and Reel; Package Quantity: 5000; Operating Supply Voltage: 33V; Breakdown Voltage: 36.7V; Clamping Voltage: 53.3V; Polarity: Bidirectional; Termination: SMD/SMT; Number of Bidirectional Channels: 1; Min Breakdown Voltage: 36.7V; Number of Elements: 1; Peak Pulse Current: 7.5A; Power Dissipation: 400W; Voltage Rating (DC): 33V; Composition: Zener; Length: 5.28mm; Height: 2.29mm; Width: 2.79mm; REACH SVHC: No SVHC; Lead Free: Lead Free; ComponentLink1URL: https://datasheet.ciiva.com/331/littelfuse-tvs-diode-smaj-datasheet-pdf-331111.pdf?src-supplier=Digi-Key; ComponentLink1Description: https://datasheet.ciiva.com/331/littelfuse-tvs-diode-smaj-datasheet-pdf-331111.pdf?src-supplier=Digi-Key; ComponentLink2URL: https://datasheet.ciiva.com/331/littelfuse-tvs-diode-smaj-datasheet-pdf-331112.pdf?src-supplier=Digi-Key; ComponentLink2Description: https://datasheet.ciiva.com/331/littelfuse-tvs-diode-smaj-datasheet-pdf-331112.pdf?src-supplier=Digi-Key; ComponentLink3URL: https://datasheet.ciiva.com/16487/littelfuse-tvs-diode-smaj-16487784.pdf?src-supplier=Future+Electronics; ComponentLink3Description: https://datasheet.ciiva.com/16487/littelfuse-tvs-diode-smaj-16487784.pdf?src-supplier=Future+Electronics; ComponentLink4URL: https://datasheet.ciiva.com/331/littelfuse-tvs-diode-smaj-datasheet-pdf-331113.pdf?src-supplier=Digi-Key; ComponentLink4Description: https://datasheet.ciiva.com/331/littelfuse-tvs-diode-smaj-datasheet-pdf-331113.pdf?src-supplier=Digi-Key; ComponentLink5URL: https://datasheet.ciiva.com/28473/607617-28473417.pdf?src-supplier=Element14; ComponentLink5Description: https://datasheet.ciiva.com/28473/607617-28473417.pdf?src-supplier=Element14; Reverse Standoff Voltage: 33V
TVS10 TVS20 TVS31-TVS36 = TVS-TPD2E2U06QDCKRQ1: TVS DIODE 5.5V 12.4V SC70-3; Manufacturer: Texas Instruments; Capacitance: 1.5pF; Interface: LVDS,USB,Ethernet; Number of Channels: 2; Supplier 1: Digi-Key; Supplier Part Number 1: 296-44302-1-ND; Manufacturer Part Number: TPD2E2U06QDCKRQ1; Stock: 14322; Pricing: 1=0.61, 10=0.49, 100=0.385, 500=0.266, 1000=0.21 (USD); RoHS: No; Min Operating Temperature: -40°C; Max Operating Temperature: 125°C; Lead Free: Lead Free; ComponentLink1URL: http://www.ti.com/general/docs/suppproductinfo.tsp?distId=10&amp;gotoUrl=http%3A%2F%2Fwww.ti.com%2Flit%2Fgpn%2Ftpd2e2u06-q1&src-supplier=Digi-Key; ComponentLink1Description: http://www.ti.com/general/docs/suppproductinfo.tsp?distId=10&amp;gotoUrl=http%3A%2F%2Fwww.ti.com%2Flit%2Fgpn%2Ftpd2e2u06-q1&src-supplier=Digi-Key; ComponentLink2URL: http://www.ti.com/lit/pdf/sszt035?src-supplier=Digi-Key; ComponentLink2Description: http://www.ti.com/lit/pdf/sszt035?src-supplier=Digi-Key